# EAGLE design PCB-SLIDER20 (EAGLE 6.4)
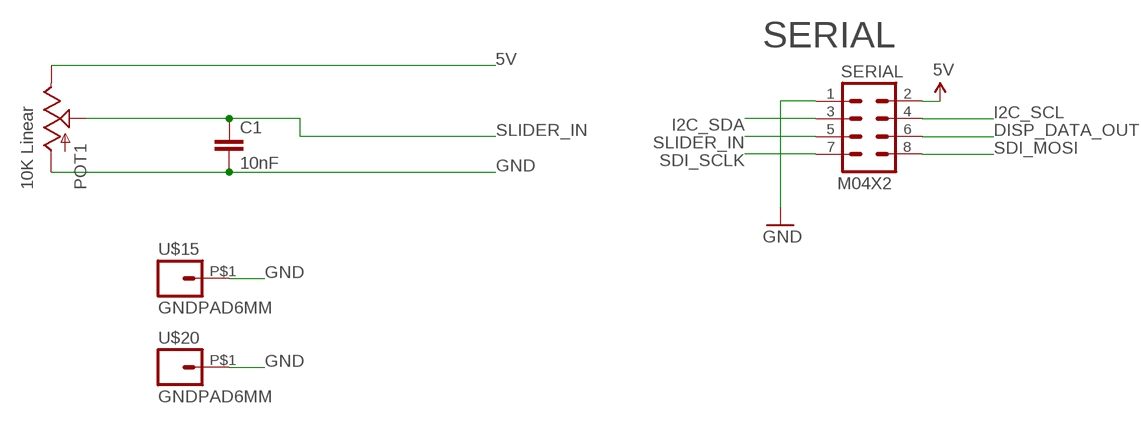
[diagram p0: schematic, sheet 1]

## Parts
C1  10nF  CAP0603-CAP  [0603-CAP]
POT1  10K Linear  SLIDER20  [SLIDER20]
SERIAL  M04X2  [2X4]
U$15  GNDPAD6MM  [3.2MMPAD6MM]
U$20  GNDPAD6MM  [3.2MMPAD6MM]

## Nets
5V [Power]: POT1.1(E) SERIAL.2
DISP_DATA_OUT: SERIAL.6
GND [Power]: C1.2 POT1.3(A) SERIAL.1 U$15.P$1 U$20.P$1
I2C_SCL: SERIAL.4
I2C_SDA: SERIAL.3
SDI_MOSI: SERIAL.8
SDI_SCLK: SERIAL.7
SLIDER_IN: C1.1 POT1.2A(S) SERIAL.5

## Notes on the sheet
- SERIAL

## Library data of the parts
C1 = SparkFun:CAP: Capacitor Standard 0603 ceramic capacitor, and 0.1" leaded capacitor.
POT1 = SKAARHOJ:SLIDER
SERIAL = SparkFun:M04X2
U$15 U$20 = SKAARHOJ:GNDPAD

## Net classes
0 default: width 0.203 mm, drill 0.406 mm, clearance 0.203 mm
1 Power: width 0.406 mm, drill 0.61 mm, clearance 0.203 mm

## Board
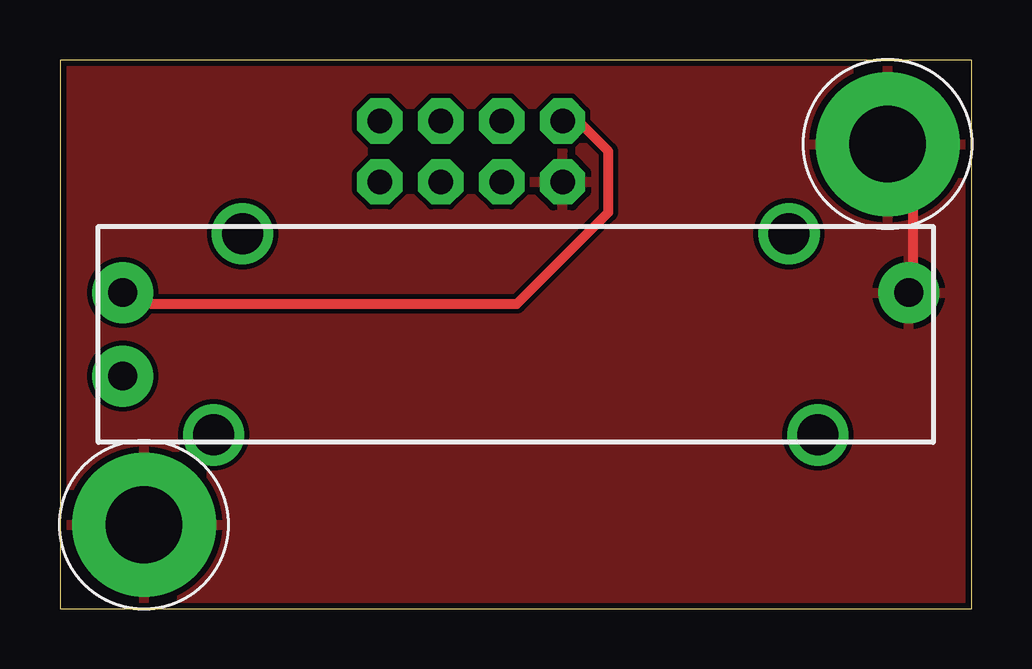
[diagram p1: board, top side]
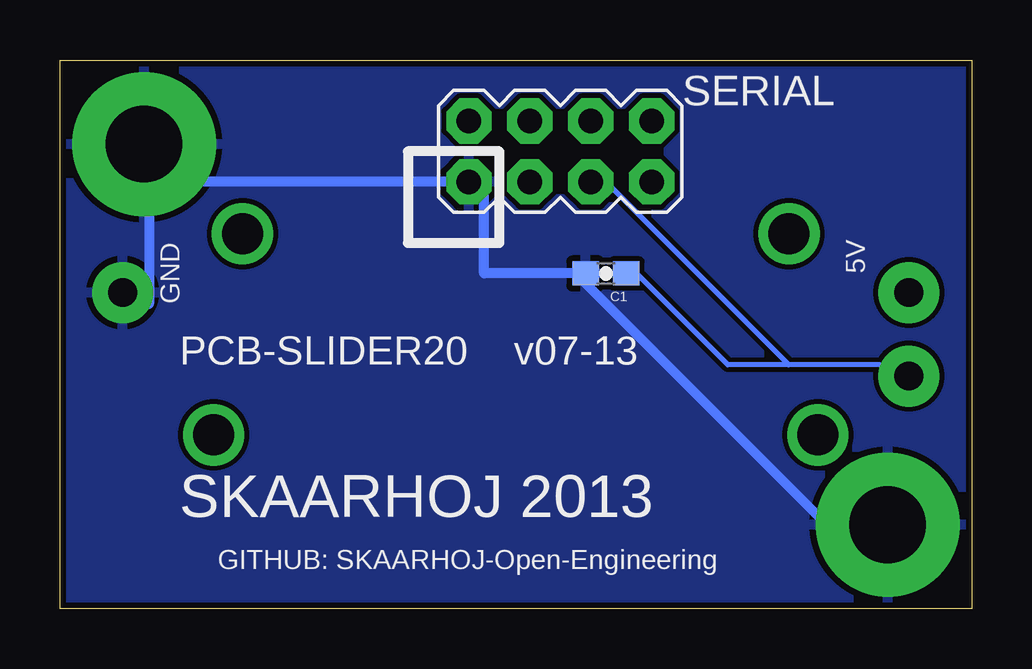
[diagram p2: board, bottom side, seen from below]

Size 38 x 22.86 mm. Coordinates in mm from the lower left corner, seen from the top.
Outline: 0,0 38,0 38,22.86 0,22.86 0,0
Copper layers (1*16): Top 0.035mm / dielectric 1.5mm / Bottom 0.035mm
Design rules "Fusion_eagle_rule_v1.1": minimum track width 6mil, minimum drill 12mil, track to track 6mil, track to pad 6mil, pad to pad 6mil, via to via 6mil, smd to smd 0mil, copper to edge 10mil, drill to drill 10mil, minimum pad ring 10mil, minimum via ring 6mil, stop-mask expansion 2mil, vias tented up to drill 100mil, thermal gap 10mil

### Footprints (pad centres in the part's own frame; a part is rotated, then mirrored left to right if it is on the bottom)
0603-CAP = smd 1.1 x 1: 1 -0.85,0; 2 0.85,0
SLIDER20 = drill 1.194 pad 2.54: 1 -16.383,1.74; 2A -16.383,-1.74; 3 16.383,1.74 | drill 1.702: P$1 -11.392,4.191; P$2 11.392,4.191; P$3 12.598,-4.191; P$4 -12.598,-4.191
2X4 = drill 1.016 pad 1.88 octagon: 1 -3.81,-1.27; 2 -3.81,1.27; 3 -1.27,-1.27; 4 -1.27,1.27; 5 1.27,-1.27; 6 1.27,1.27; 7 3.81,-1.27; 8 3.81,1.27
3.2MMPAD6MM = drill 3.2 pad 6: P$1 0,0

### Placement (x,y rotation side)
C1  15.24,13.97 180 bottom
POT1  19,11.43 0 top
SERIAL  17.14,19.05 0 bottom
U$15  3.5,3.5 0 top
U$20  34.5,19.36 0 top

### Tracks (layer width: path | path; a pad name or v marks a point on that pad's centre or on a via)
5V
  Top 0.406: SERIAL.2 21.59,20.32 22.86,19.05 22.86,16.51 19.05,12.7 3.81,12.7 POT1.1
GND
  Top 0.406: POT1.3 35.56,13.97 35.56,19.05 U$20.P$1
  Bottom 0.406: 16.51,13.97 6.35,3.81 3.81,3.81 U$15.P$1 | 16.51,13.97 20.32,13.97 20.32,17.78 SERIAL.1 34.29,17.78 34.29,12.7 POT1.3 | 16.51,13.97 C1.2
  pour Top: 0,0 38.1,0 38.1,22.86 0,22.86
  pour Bottom: 0,0 38.1,0 38.1,22.86 0,22.86
SLIDER_IN
  Bottom 0.203: 7.62,10.16 3.81,10.16 POT1.2A | 7.62,10.16 10.16,10.16 13.97,13.97 C1.1 | 7.62,10.16 15.24,17.78 SERIAL.5

### Text on the board
_bsilk: 5V | GND | PCB-SLIDER20 v07-13 | SKAARHOJ 2013 | GITHUB: SKAARHOJ-Open-Engineering